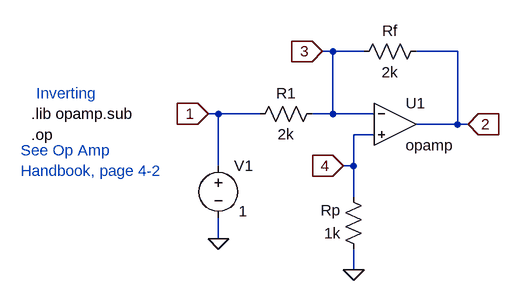
[diagram p0: schematic inverting.asc]
inverting.asc, the LTspice schematic file:
Version 4
SHEET 1 880 680
WIRE 272 -16 256 -16
WIRE 320 -16 272 -16
WIRE 464 -16 400 -16
WIRE 96 80 80 80
WIRE 160 80 96 80
WIRE 272 80 272 -16
WIRE 272 80 240 80
WIRE 336 80 272 80
WIRE 464 96 464 -16
WIRE 464 96 400 96
WIRE 480 96 464 96
WIRE 336 112 304 112
WIRE 96 160 96 80
WIRE 304 160 304 112
WIRE 304 160 288 160
WIRE 304 208 304 160
WIRE 96 272 96 240
WIRE 304 320 304 288
FLAG 304 320 0
FLAG 96 272 0
FLAG 80 80 1
IOPIN 80 80 In
FLAG 480 96 2
IOPIN 480 96 In
FLAG 288 160 4
IOPIN 288 160 In
FLAG 256 -16 3
IOPIN 256 -16 In
SYMBOL voltage 96 144 R0
WINDOW 123 29 90 Left 2
WINDOW 39 0 0 Left 0
WINDOW 3 31 86 Left 2
SYMATTR Value 1
SYMATTR InstName V1
SYMBOL OpAmps\\opamp 368 32 R0
SYMATTR InstName U1
SYMBOL res 256 64 R90
WINDOW 0 0 56 VBottom 2
WINDOW 3 32 56 VTop 2
SYMATTR InstName R1
SYMATTR Value 2k
SYMBOL res 320 304 R180
WINDOW 0 36 76 Left 2
WINDOW 3 36 40 Left 2
SYMATTR InstName Rp
SYMATTR Value 1k
SYMBOL res 304 0 R270
WINDOW 0 32 56 VTop 2
WINDOW 3 0 56 VBottom 2
SYMATTR InstName Rf
SYMATTR Value 2k
TEXT -192 80 Left 2 !.lib opamp.sub
TEXT -192 112 Left 2 !.op
TEXT -184 48 Left 2 ;Inverting
TEXT -208 136 Left 2 ;See Op Amp \nHandbook, page 4-2

The netlist it stands for:
* inverting.asc
V1 1 0 1
XU1 3 4 2 opamp Aol=100K GBW=10Meg  ; pins invin noninvin out
R1 3 1 2k
Rp 0 4 1k
Rf 3 2 2k
.lib opamp.sub
.op
* Inverting
* See Op Amp
* Handbook, page 4-2
.backanno
.end